# Altium schematic sheet 3_Peripherals.SchDoc
size A; SheetNumber: 4; SheetTotal: 4
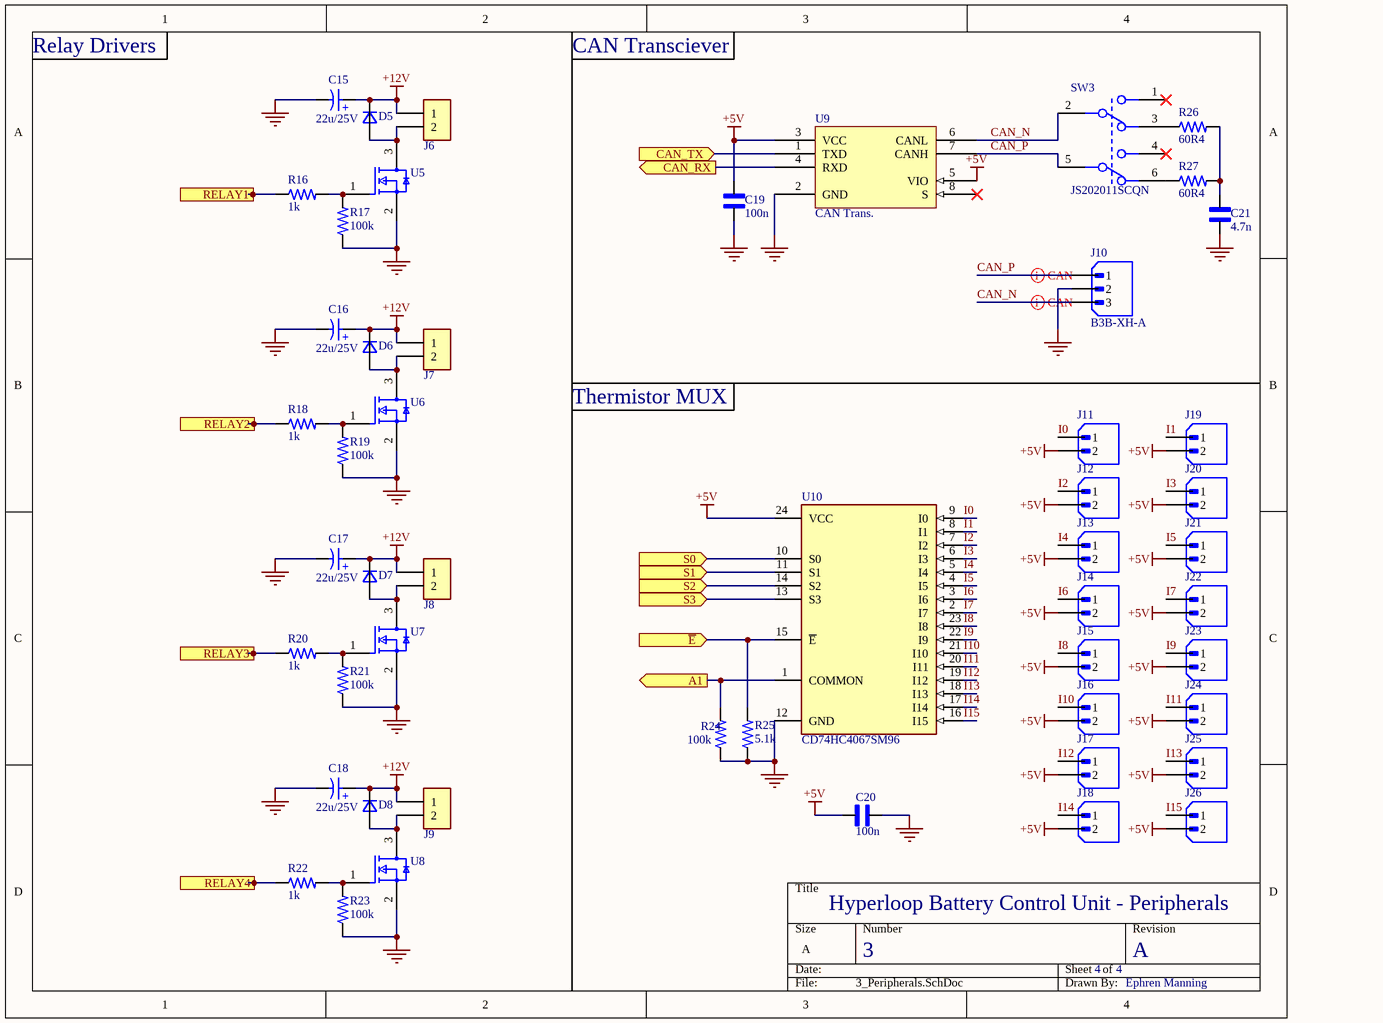
[diagram p0: 3_Peripherals.SchDoc]

## Parts
C15  22u/25V  [WCAP-ASLI_D5H5.5]
C16  22u/25V  [WCAP-ASLI_D5H5.5]
C17  22u/25V  [WCAP-ASLI_D5H5.5]
C18  22u/25V  [WCAP-ASLI_D5H5.5]
C19  100n  [CAP_0603-Footprint]
C20  100n  [CAP_0603-Footprint]
C21  4.7n  [CAP_0603-Footprint]
D5  1N4007FL  [SOD-123_ONS]  (value not drawn)
D6  1N4007FL  [SOD-123_ONS]  (value not drawn)
D7  1N4007FL  [SOD-123_ONS]  (value not drawn)
D8  1N4007FL  [SOD-123_ONS]  (value not drawn)
J6  282837-2  [TE_282837-2]  (value not drawn)
J7  282837-2  [TE_282837-2]  (value not drawn)
J8  282837-2  [TE_282837-2]  (value not drawn)
J9  282837-2  [TE_282837-2]  (value not drawn)
J10  B3B-XH-A  [JST_B3B-XH-A]
J11  B2B-XH-A  [JST_B2B-XH-A]  (value not drawn)
J12  B2B-XH-A  [JST_B2B-XH-A]  (value not drawn)
J13  B2B-XH-A  [JST_B2B-XH-A]  (value not drawn)
J14  B2B-XH-A  [JST_B2B-XH-A]  (value not drawn)
J15  B2B-XH-A  [JST_B2B-XH-A]  (value not drawn)
J16  B2B-XH-A  [JST_B2B-XH-A]  (value not drawn)
J17  B2B-XH-A  [JST_B2B-XH-A]  (value not drawn)
J18  B2B-XH-A  [JST_B2B-XH-A]  (value not drawn)
J19  B2B-XH-A  [JST_B2B-XH-A]  (value not drawn)
J20  B2B-XH-A  [JST_B2B-XH-A]  (value not drawn)
J21  B2B-XH-A  [JST_B2B-XH-A]  (value not drawn)
J22  B2B-XH-A  [JST_B2B-XH-A]  (value not drawn)
J23  B2B-XH-A  [JST_B2B-XH-A]  (value not drawn)
J24  B2B-XH-A  [JST_B2B-XH-A]  (value not drawn)
J25  B2B-XH-A  [JST_B2B-XH-A]  (value not drawn)
J26  B2B-XH-A  [JST_B2B-XH-A]  (value not drawn)
R16  1k  [RES_0603-Footprint-1]
R17  100k  [RES_0603-Footprint-1]
R18  1k  [RES_0603-Footprint-1]
R19  100k  [RES_0603-Footprint-1]
R20  1k  [RES_0603-Footprint-1]
R21  100k  [RES_0603-Footprint-1]
R22  1k  [RES_0603-Footprint-1]
R23  100k  [RES_0603-Footprint-1]
R24  100k  [RES_0603-Footprint-1]
R25  5.1k  [RES_0603-Footprint-1]
R26  60R4  [RES_0603-Footprint-1]
R27  60R4  [RES_0603-Footprint-1]
SW3  JS202011SCQN  [FP-JS202011SCQN-MFG]
U5  PMV20XNER  [SOT95P230X110-3N]  (value not drawn)
U6  PMV20XNER  [SOT95P230X110-3N]  (value not drawn)
U7  PMV20XNER  [SOT95P230X110-3N]  (value not drawn)
U8  PMV20XNER  [SOT95P230X110-3N]  (value not drawn)
U9  CAN Trans.  [SOIC127P600X175-8N]
U10  CD74HC4067SM96  [CD74HC4067SM96 - SSOP24]

## Ports
A1 (out, see 0_Overview[3B], 2_MCU[3A]), CAN_RX (out, see 0_Overview[3C], 2_MCU[3B]), CAN_TX (in, see 0_Overview[3C], 2_MCU[3B]), RELAY1 (in, see 0_Overview[3C], 2_MCU[3B]), RELAY2 (in, see 0_Overview[3C], 2_MCU[3B]), RELAY3 (in, see 0_Overview[3C], 2_MCU[3B]), RELAY4 (in, see 0_Overview[3C], 2_MCU[3B]), S0 (in, see 0_Overview[3B], 2_MCU[3C]), S1 (in, see 0_Overview[3B], 2_MCU[3C]), S2 (in, see 0_Overview[3B], 2_MCU[3C]), S3 (in, see 0_Overview[3B], 2_MCU[3C]), ~{E} (in, see 0_Overview[3B], 2_MCU[3B])

## Nets
+5V: C19.2 C20.2 J11.2 J12.2 J13.2 J14.2 J15.2 J16.2 J17.2 J18.2 J19.2 J20.2 J21.2 J22.2 J23.2 J24.2 J25.2 J26.2 U9.3(VCC) U9.5(VIO) U10.24(VCC)
+12V: C15.1(P) C16.1(P) C17.1(P) C18.1(P) D5.1(K) D6.1(K) D7.1(K) D8.1(K) J6.1 J7.1 J8.1 J9.1
GND: C15.2(N) C16.2(N) C17.2(N) C18.2(N) C19.1 C20.1 C21.1 J10.2 R17.1 R19.1 R21.1 R23.1 R24.1 R25.1 U5.2(Source) U6.2(Source) U7.2(Source) U8.2(Source) U9.2(GND) U10.12(GND)
A1: R24.2 U10.1(COMMON) ; port A1
CAN_N: J10.3 SW3.2 U9.6(CANL)
CAN_P: J10.1 SW3.5 U9.7(CANH)
CAN_RX: U9.4(RXD) ; port CAN_RX
CAN_TX: U9.1(TXD) ; port CAN_TX
~{E}: R25.2 U10.15(~{E}) ; port ~{E}
I0: J11.1 U10.9(I0)
I1: J19.1 U10.8(I1)
I2: J12.1 U10.7(I2)
I3: J20.1 U10.6(I3)
I4: J13.1 U10.5(I4)
I5: J21.1 U10.4(I5)
I6: J14.1 U10.3(I6)
I7: J22.1 U10.2(I7)
I8: J15.1 U10.23(I8)
I9: J23.1 U10.22(I9)
I10: J16.1 U10.21(I10)
I11: J24.1 U10.20(I11)
I12: J17.1 U10.19(I12)
I13: J25.1 U10.18(I13)
I14: J18.1 U10.17(I14)
I15: J26.1 U10.16(I15)
RELAY1: R16.1 ; port RELAY1
RELAY2: R18.1 ; port RELAY2
RELAY3: R20.1 ; port RELAY3
RELAY4: R22.1 ; port RELAY4
S0: U10.10(S0) ; port S0
S1: U10.11(S1) ; port S1
S2: U10.14(S2) ; port S2
S3: U10.13(S3) ; port S3
NetC21_2: C21.2 R26.2 R27.2
NetD5_2: D5.2(A) J6.2 U5.3(Drain)
NetD6_2: D6.2(A) J7.2 U6.3(Drain)
NetD7_2: D7.2(A) J8.2 U7.3(Drain)
NetD8_2: D8.2(A) J9.2 U8.3(Drain)
NetR16_2: R16.2 R17.2 U5.1(Gate)
NetR18_2: R18.2 R19.2 U6.1(Gate)
NetR20_2: R20.2 R21.2 U7.1(Gate)
NetR22_2: R22.2 R23.2 U8.1(Gate)
NetR26_1: R26.1 SW3.3
NetR27_1: R27.1 SW3.6

Not connected (* = marked no-connect by the designer): SW3 1* 4*; U9 8(S)*

## Layout directives
differential pair: CAN_N, CAN_P

## Notes on the sheet
- Relay Drivers
- CAN Transciever
- Thermistor MUX
- Hyperloop Battery Control Unit - Peripherals
- 3
- 4
- A
- Ephren Manning
- (in symbol CMP-00027-1) +

## Library data of the parts
C15-C18 = CMP-00027-1: 22uF/25V Alum; Manufacturer 1: Würth Elektronik; Manufacturer Part Number 1: 865080442004
C19 C20 = CMP-00029-2: 100nF/16V ±10% Ceramic 0603; Manufacturer Part Number 1: CL10B104KO8NNNC; Manufacturer 1: Samsung Electro-Mechanics
C21 = CMP-00036-1: 4.7nF/16V 0603 Ceramic Cap; Manufacturer 1: Walsin Technology Corporation; Manufacturer Part Number 1: 0603B472K160CT
D5-D8 = CMP-00038-2: 1000V 1A Diode; Manufacturer 1: SMC Diode Solutions; Manufacturer Part Number 1: 1N4007FL
J6-J9 = CMP-079-000000-3: 2x Screw Terminal; Manufacturer 1: TE Connectivity; Manufacturer Part Number 1: 282837-2
J10 = CMP-082-000000-2: 3x Pin JST-XH-A; Manufacturer 1: JST Sales; Manufacturer Part Number 1: B3B-XH-A
J11-J26 = CMP-074-000001-3: 2x Pin JST-XH; Manufacturer 1: JST Sales America; Manufacturer Part Number 1: B2B-XH-A
R16 R18 R20 R22 = CMP-00039-1: 1k 1% 0.1W 0603; Manufacturer 1: YAGEO; Manufacturer Part Number 1: RC0603FR-071KL
R17 R19 R21 R23 R24 = CMP-030-000000-4: 100k ±1% 0.1W, 0603; Manufacturer 1: Yageo; Manufacturer Part Number 1: RC0603FR-07100KL
R25 = CMP-028-000000-5: 5.1k Ohms ±1% 0.1W 0603; Manufacturer Part Number 1: RC0603FR-075K1L; Manufacturer 1: Yageo
R26 R27 = CMP-046-000000-5: 60.4 Ohms ±1% 0.1W 0603; Manufacturer Part Number 1: RC0603FR-0760R4L; Manufacturer 1: YAGEO
SW3 = CMP-00035-2: DPDT SMD SWITCH 300mA 6V; Manufacturer 1: C&K; Manufacturer Part Number 1: JS202011SCQN
U5-U8 = CMP-076-000000-2: N-Channel 30 V 5.7A (Ta) 510mW (Ta), 6.94W (Tc) Surface Mount TO-236AB; Manufacturer 1: Nexperia USA Inc.; Manufacturer Part Number 1: PMV20XNER
U9 = CMP-00010-6: CAN Transceiver, NXP; Manufacturer Part Number 1: TJA1051T/3,118; Manufacturer 1: NXP USA Inc.
U10 = CMP-00031-4: 16:1 Mux 160 Ohm 24-SSOP; Manufacturer 1: Texas Instruments; Manufacturer Part Number 1: CD74HC4067SM96